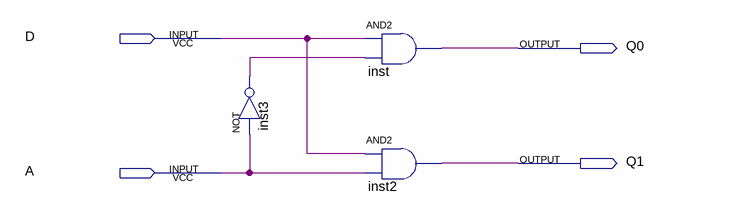
[diagram p0: schematic sheet]
// Quartus schematic demult1_2_Quartus.bdf as structural Verilog: 3 symbols, 4 pins
module demult1_2_Quartus (
  input  D,
  input  A,
  output Q0,
  output Q1
);

  wire inst3_out;

  not inst3 (inst3_out, A);
  and inst (Q0, D, inst3_out);
  and inst2 (Q1, D, A);
endmodule
